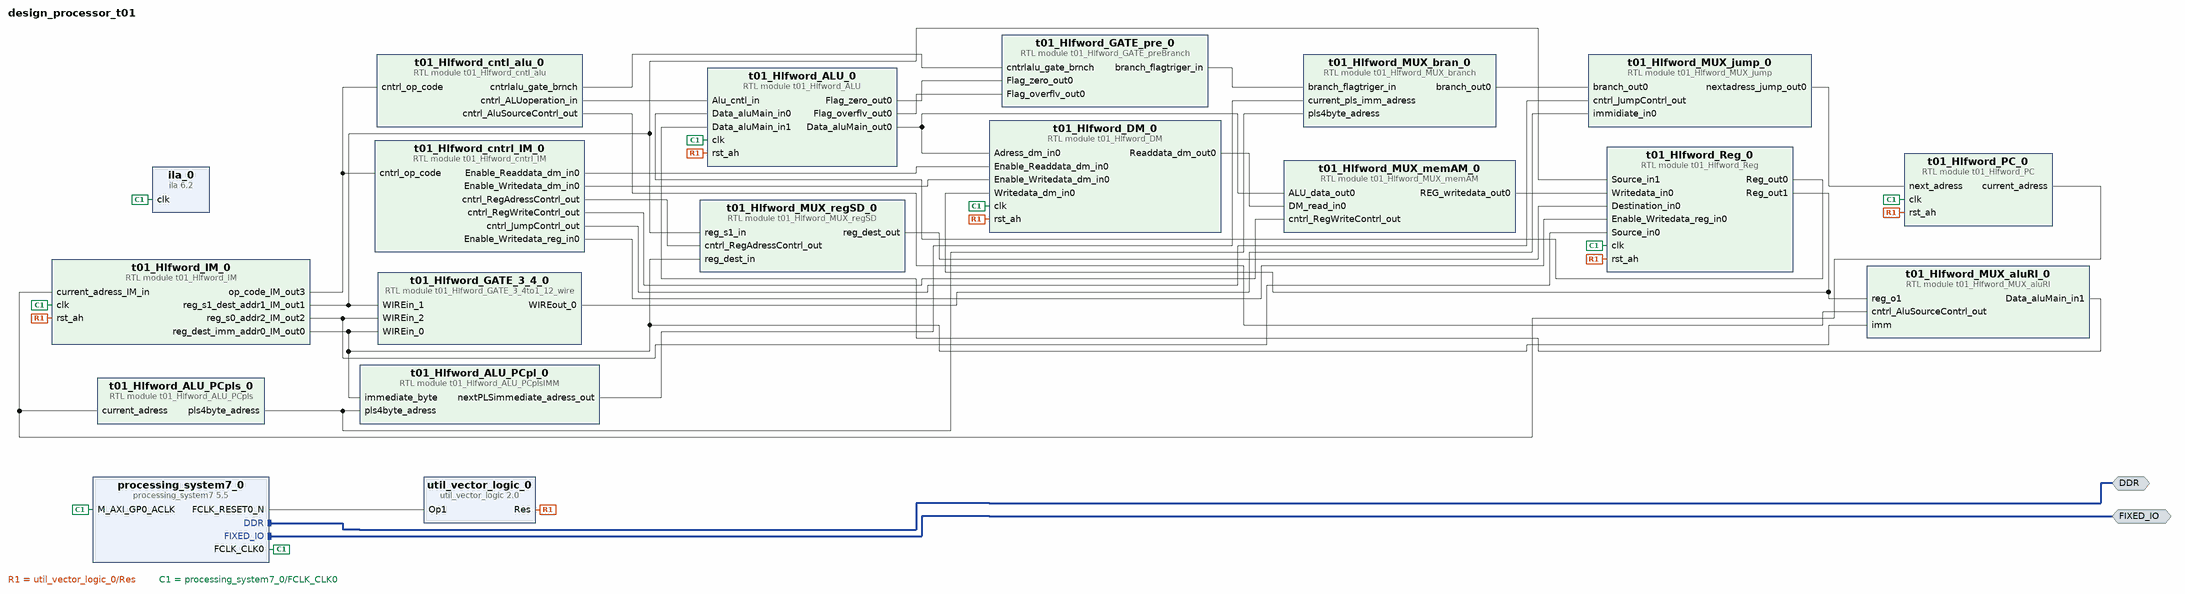
[diagram p0: block diagram of the top level]
# Vivado block design design_processor_t01, xc7z020clg484-1, Vivado 2020.1
create_bd_design design_processor_t01

create_bd_intf_port -mode Master -vlnv xilinx.com:interface:ddrx_rtl:1.0 DDR
create_bd_intf_port -mode Master -vlnv xilinx.com:display_processing_system7:fixedio_rtl:1.0 FIXED_IO

create_bd_cell -type ip -vlnv xilinx.com:ip:ila:6.2 ila_0
create_bd_cell -type module -reference t01_Hlfword_GATE_preBranch t01_Hlfword_GATE_pre_0
create_bd_cell -type ip -vlnv xilinx.com:ip:processing_system7:5.5 processing_system7_0
set_property -dict [list \
  CONFIG.PCW_APU_PERIPHERAL_FREQMHZ 666.666667 \
  CONFIG.PCW_ENET0_ENET0_IO {MIO 16 .. 27} \
  CONFIG.PCW_ENET0_GRP_MDIO_ENABLE 1 \
  CONFIG.PCW_ENET0_GRP_MDIO_IO {MIO 52 .. 53} \
  CONFIG.PCW_ENET0_PERIPHERAL_ENABLE 1 \
  CONFIG.PCW_ENET0_RESET_ENABLE 0 \
  CONFIG.PCW_ENET_RESET_ENABLE 1 \
  CONFIG.PCW_ENET_RESET_SELECT {Share reset pin} \
  CONFIG.PCW_FPGA0_PERIPHERAL_FREQMHZ 100.000000 \
  CONFIG.PCW_FPGA1_PERIPHERAL_FREQMHZ 150.000000 \
  CONFIG.PCW_GPIO_MIO_GPIO_ENABLE 1 \
  CONFIG.PCW_GPIO_MIO_GPIO_IO MIO \
  CONFIG.PCW_I2C_RESET_ENABLE 1 \
  CONFIG.PCW_PRESET_BANK1_VOLTAGE {LVCMOS 1.8V} \
  CONFIG.PCW_QSPI_GRP_SINGLE_SS_ENABLE 1 \
  CONFIG.PCW_QSPI_GRP_SINGLE_SS_IO {MIO 1 .. 6} \
  CONFIG.PCW_QSPI_PERIPHERAL_ENABLE 1 \
  CONFIG.PCW_QSPI_QSPI_IO {MIO 1 .. 6} \
  CONFIG.PCW_SD0_GRP_CD_ENABLE 1 \
  CONFIG.PCW_SD0_GRP_CD_IO {MIO 47} \
  CONFIG.PCW_SD0_GRP_WP_ENABLE 1 \
  CONFIG.PCW_SD0_GRP_WP_IO {MIO 46} \
  CONFIG.PCW_SD0_PERIPHERAL_ENABLE 1 \
  CONFIG.PCW_SD0_SD0_IO {MIO 40 .. 45} \
  CONFIG.PCW_SDIO_PERIPHERAL_FREQMHZ 50 \
  CONFIG.PCW_SINGLE_QSPI_DATA_MODE x4 \
  CONFIG.PCW_TTC0_PERIPHERAL_ENABLE 1 \
  CONFIG.PCW_TTC0_TTC0_IO EMIO \
  CONFIG.PCW_UART1_PERIPHERAL_ENABLE 1 \
  CONFIG.PCW_UART1_UART1_IO {MIO 48 .. 49} \
  CONFIG.PCW_UART_PERIPHERAL_FREQMHZ 50 \
  CONFIG.PCW_UIPARAM_DDR_FREQ_MHZ 533.333313 \
  CONFIG.PCW_UIPARAM_DDR_PARTNO {MT41J128M16 HA-15E} \
  CONFIG.PCW_USB0_PERIPHERAL_ENABLE 1 \
  CONFIG.PCW_USB0_RESET_ENABLE 0 \
  CONFIG.PCW_USB0_USB0_IO {MIO 28 .. 39} \
  CONFIG.PCW_USB_RESET_ENABLE 1 \
  CONFIG.PCW_USB_RESET_SELECT {Share reset pin} \
  CONFIG.preset ZedBoard \
] [get_bd_cells processing_system7_0]
# 223 more settings of processing_system7_0 are not shown: defaults, MIO pin electricals, DDR timing, and values the tool derives
create_bd_cell -type module -reference t01_Hlfword_PC t01_Hlfword_PC_0
create_bd_cell -type module -reference t01_Hlfword_MUX_branch t01_Hlfword_MUX_bran_0
create_bd_cell -type module -reference t01_Hlfword_MUX_jump t01_Hlfword_MUX_jump_0
create_bd_cell -type module -reference t01_Hlfword_MUX_memAM t01_Hlfword_MUX_memAM_0
create_bd_cell -type module -reference t01_Hlfword_MUX_regSD t01_Hlfword_MUX_regSD_0
create_bd_cell -type module -reference t01_Hlfword_GATE_3_4to1_12_wire t01_Hlfword_GATE_3_4_0
create_bd_cell -type module -reference t01_Hlfword_MUX_aluRI t01_Hlfword_MUX_aluRI_0
create_bd_cell -type module -reference t01_Hlfword_ALU_PCplsIMM t01_Hlfword_ALU_PCpl_0
create_bd_cell -type module -reference t01_Hlfword_ALU_PCpls t01_Hlfword_ALU_PCpls_0
create_bd_cell -type module -reference t01_Hlfword_cntrl_IM t01_Hlfword_cntrl_IM_0
create_bd_cell -type module -reference t01_Hlfword_cntl_alu t01_Hlfword_cntl_alu_0
create_bd_cell -type module -reference t01_Hlfword_IM t01_Hlfword_IM_0
create_bd_cell -type module -reference t01_Hlfword_DM t01_Hlfword_DM_0
create_bd_cell -type module -reference t01_Hlfword_Reg t01_Hlfword_Reg_0
create_bd_cell -type module -reference t01_Hlfword_ALU t01_Hlfword_ALU_0
create_bd_cell -type ip -vlnv xilinx.com:ip:util_vector_logic:2.0 util_vector_logic_0
set_property -dict {CONFIG.C_OPERATION not CONFIG.C_SIZE 1} [get_bd_cells util_vector_logic_0]

# ---- connections ----

connect_bd_intf_net [get_bd_intf_ports DDR] [get_bd_intf_pins processing_system7_0/DDR]
connect_bd_intf_net [get_bd_intf_ports FIXED_IO] [get_bd_intf_pins processing_system7_0/FIXED_IO]
connect_bd_net [get_bd_pins t01_Hlfword_PC_0/current_adress] \
  [get_bd_pins t01_Hlfword_ALU_PCpls_0/current_adress] [get_bd_pins t01_Hlfword_IM_0/current_adress_IM_in]
connect_bd_net [get_bd_pins t01_Hlfword_IM_0/reg_s0_addr2_IM_out2] \
  [get_bd_pins t01_Hlfword_GATE_3_4_0/WIREin_2] [get_bd_pins t01_Hlfword_Reg_0/Source_in0]
connect_bd_net [get_bd_pins t01_Hlfword_IM_0/reg_s1_dest_addr1_IM_out1] \
  [get_bd_pins t01_Hlfword_MUX_regSD_0/reg_s1_in] [get_bd_pins t01_Hlfword_GATE_3_4_0/WIREin_1] \
  [get_bd_pins t01_Hlfword_Reg_0/Source_in1]
connect_bd_net [get_bd_pins t01_Hlfword_IM_0/reg_dest_imm_addr0_IM_out0] \
  [get_bd_pins t01_Hlfword_MUX_regSD_0/reg_dest_in] [get_bd_pins t01_Hlfword_GATE_3_4_0/WIREin_0] \
  [get_bd_pins t01_Hlfword_MUX_aluRI_0/imm] [get_bd_pins t01_Hlfword_ALU_PCpl_0/immediate_byte]
connect_bd_net [get_bd_pins t01_Hlfword_MUX_regSD_0/reg_dest_out] [get_bd_pins t01_Hlfword_Reg_0/Destination_in0]
connect_bd_net [get_bd_pins t01_Hlfword_Reg_0/Reg_out0] [get_bd_pins t01_Hlfword_ALU_0/Data_aluMain_in0]
connect_bd_net [get_bd_pins t01_Hlfword_MUX_aluRI_0/Data_aluMain_in1] [get_bd_pins t01_Hlfword_ALU_0/Data_aluMain_in1]
connect_bd_net [get_bd_pins t01_Hlfword_Reg_0/Reg_out1] [get_bd_pins t01_Hlfword_MUX_aluRI_0/reg_o1] [get_bd_pins t01_Hlfword_DM_0/Writedata_dm_in0]
connect_bd_net [get_bd_pins t01_Hlfword_ALU_0/Data_aluMain_out0] \
  [get_bd_pins t01_Hlfword_MUX_memAM_0/ALU_data_out0] [get_bd_pins t01_Hlfword_DM_0/Adress_dm_in0]
connect_bd_net [get_bd_pins t01_Hlfword_DM_0/Readdata_dm_out0] [get_bd_pins t01_Hlfword_MUX_memAM_0/DM_read_in0]
connect_bd_net [get_bd_pins t01_Hlfword_MUX_memAM_0/REG_writedata_out0] [get_bd_pins t01_Hlfword_Reg_0/Writedata_in0]
connect_bd_net [get_bd_pins t01_Hlfword_ALU_PCpls_0/pls4byte_adress] \
  [get_bd_pins t01_Hlfword_MUX_bran_0/pls4byte_adress] [get_bd_pins t01_Hlfword_ALU_PCpl_0/pls4byte_adress]
connect_bd_net [get_bd_pins t01_Hlfword_ALU_0/Flag_zero_out0] [get_bd_pins t01_Hlfword_GATE_pre_0/Flag_zero_out0]
connect_bd_net [get_bd_pins t01_Hlfword_ALU_0/Flag_overflv_out0] [get_bd_pins t01_Hlfword_GATE_pre_0/Flag_overflv_out0]
connect_bd_net [get_bd_pins t01_Hlfword_GATE_pre_0/branch_flagtriger_in] [get_bd_pins t01_Hlfword_MUX_bran_0/branch_flagtriger_in]
connect_bd_net [get_bd_pins t01_Hlfword_ALU_PCpl_0/nextPLSimmediate_adress_out] [get_bd_pins t01_Hlfword_MUX_bran_0/current_pls_imm_adress]
connect_bd_net [get_bd_pins t01_Hlfword_MUX_bran_0/branch_out0] [get_bd_pins t01_Hlfword_MUX_jump_0/branch_out0]
connect_bd_net [get_bd_pins t01_Hlfword_MUX_jump_0/nextadress_jump_out0] [get_bd_pins t01_Hlfword_PC_0/next_adress]
connect_bd_net [get_bd_pins t01_Hlfword_IM_0/op_code_IM_out3] \
  [get_bd_pins t01_Hlfword_cntrl_IM_0/cntrl_op_code] [get_bd_pins t01_Hlfword_cntl_alu_0/cntrl_op_code]
connect_bd_net [get_bd_pins t01_Hlfword_cntl_alu_0/cntrlalu_gate_brnch] [get_bd_pins t01_Hlfword_GATE_pre_0/cntrlalu_gate_brnch]
connect_bd_net [get_bd_pins t01_Hlfword_cntl_alu_0/cntrl_AluSourceContrl_out] [get_bd_pins t01_Hlfword_MUX_aluRI_0/cntrl_AluSourceContrl_out]
connect_bd_net [get_bd_pins t01_Hlfword_cntl_alu_0/cntrl_ALUoperation_in] [get_bd_pins t01_Hlfword_ALU_0/Alu_cntl_in]
connect_bd_net [get_bd_pins t01_Hlfword_cntrl_IM_0/Enable_Readdata_dm_in0] [get_bd_pins t01_Hlfword_DM_0/Enable_Readdata_dm_in0]
connect_bd_net [get_bd_pins t01_Hlfword_cntrl_IM_0/Enable_Writedata_dm_in0] [get_bd_pins t01_Hlfword_DM_0/Enable_Writedata_dm_in0]
connect_bd_net [get_bd_pins t01_Hlfword_cntrl_IM_0/Enable_Writedata_reg_in0] [get_bd_pins t01_Hlfword_Reg_0/Enable_Writedata_reg_in0]
connect_bd_net [get_bd_pins t01_Hlfword_cntrl_IM_0/cntrl_JumpContrl_out] [get_bd_pins t01_Hlfword_MUX_jump_0/cntrl_JumpContrl_out]
connect_bd_net [get_bd_pins t01_Hlfword_cntrl_IM_0/cntrl_RegWriteContrl_out] [get_bd_pins t01_Hlfword_MUX_memAM_0/cntrl_RegWriteContrl_out]
connect_bd_net [get_bd_pins t01_Hlfword_cntrl_IM_0/cntrl_RegAdressContrl_out] [get_bd_pins t01_Hlfword_MUX_regSD_0/cntrl_RegAdressContrl_out]
connect_bd_net [get_bd_pins t01_Hlfword_GATE_3_4_0/WIREout_0] [get_bd_pins t01_Hlfword_MUX_jump_0/immidiate_in0]
connect_bd_net [get_bd_pins util_vector_logic_0/Res] \
  [get_bd_pins t01_Hlfword_PC_0/rst_ah] [get_bd_pins t01_Hlfword_IM_0/rst_ah] [get_bd_pins t01_Hlfword_DM_0/rst_ah] \
  [get_bd_pins t01_Hlfword_Reg_0/rst_ah] [get_bd_pins t01_Hlfword_ALU_0/rst_ah]
connect_bd_net [get_bd_pins processing_system7_0/FCLK_CLK0] \
  [get_bd_pins processing_system7_0/M_AXI_GP0_ACLK] [get_bd_pins ila_0/clk] [get_bd_pins t01_Hlfword_PC_0/clk] \
  [get_bd_pins t01_Hlfword_IM_0/clk] [get_bd_pins t01_Hlfword_DM_0/clk] [get_bd_pins t01_Hlfword_Reg_0/clk] \
  [get_bd_pins t01_Hlfword_ALU_0/clk]
connect_bd_net [get_bd_pins processing_system7_0/FCLK_RESET0_N] [get_bd_pins util_vector_logic_0/Op1]

validate_bd_design
save_bd_design
